# EAGLE design PowerMeter (EAGLE 6.1)
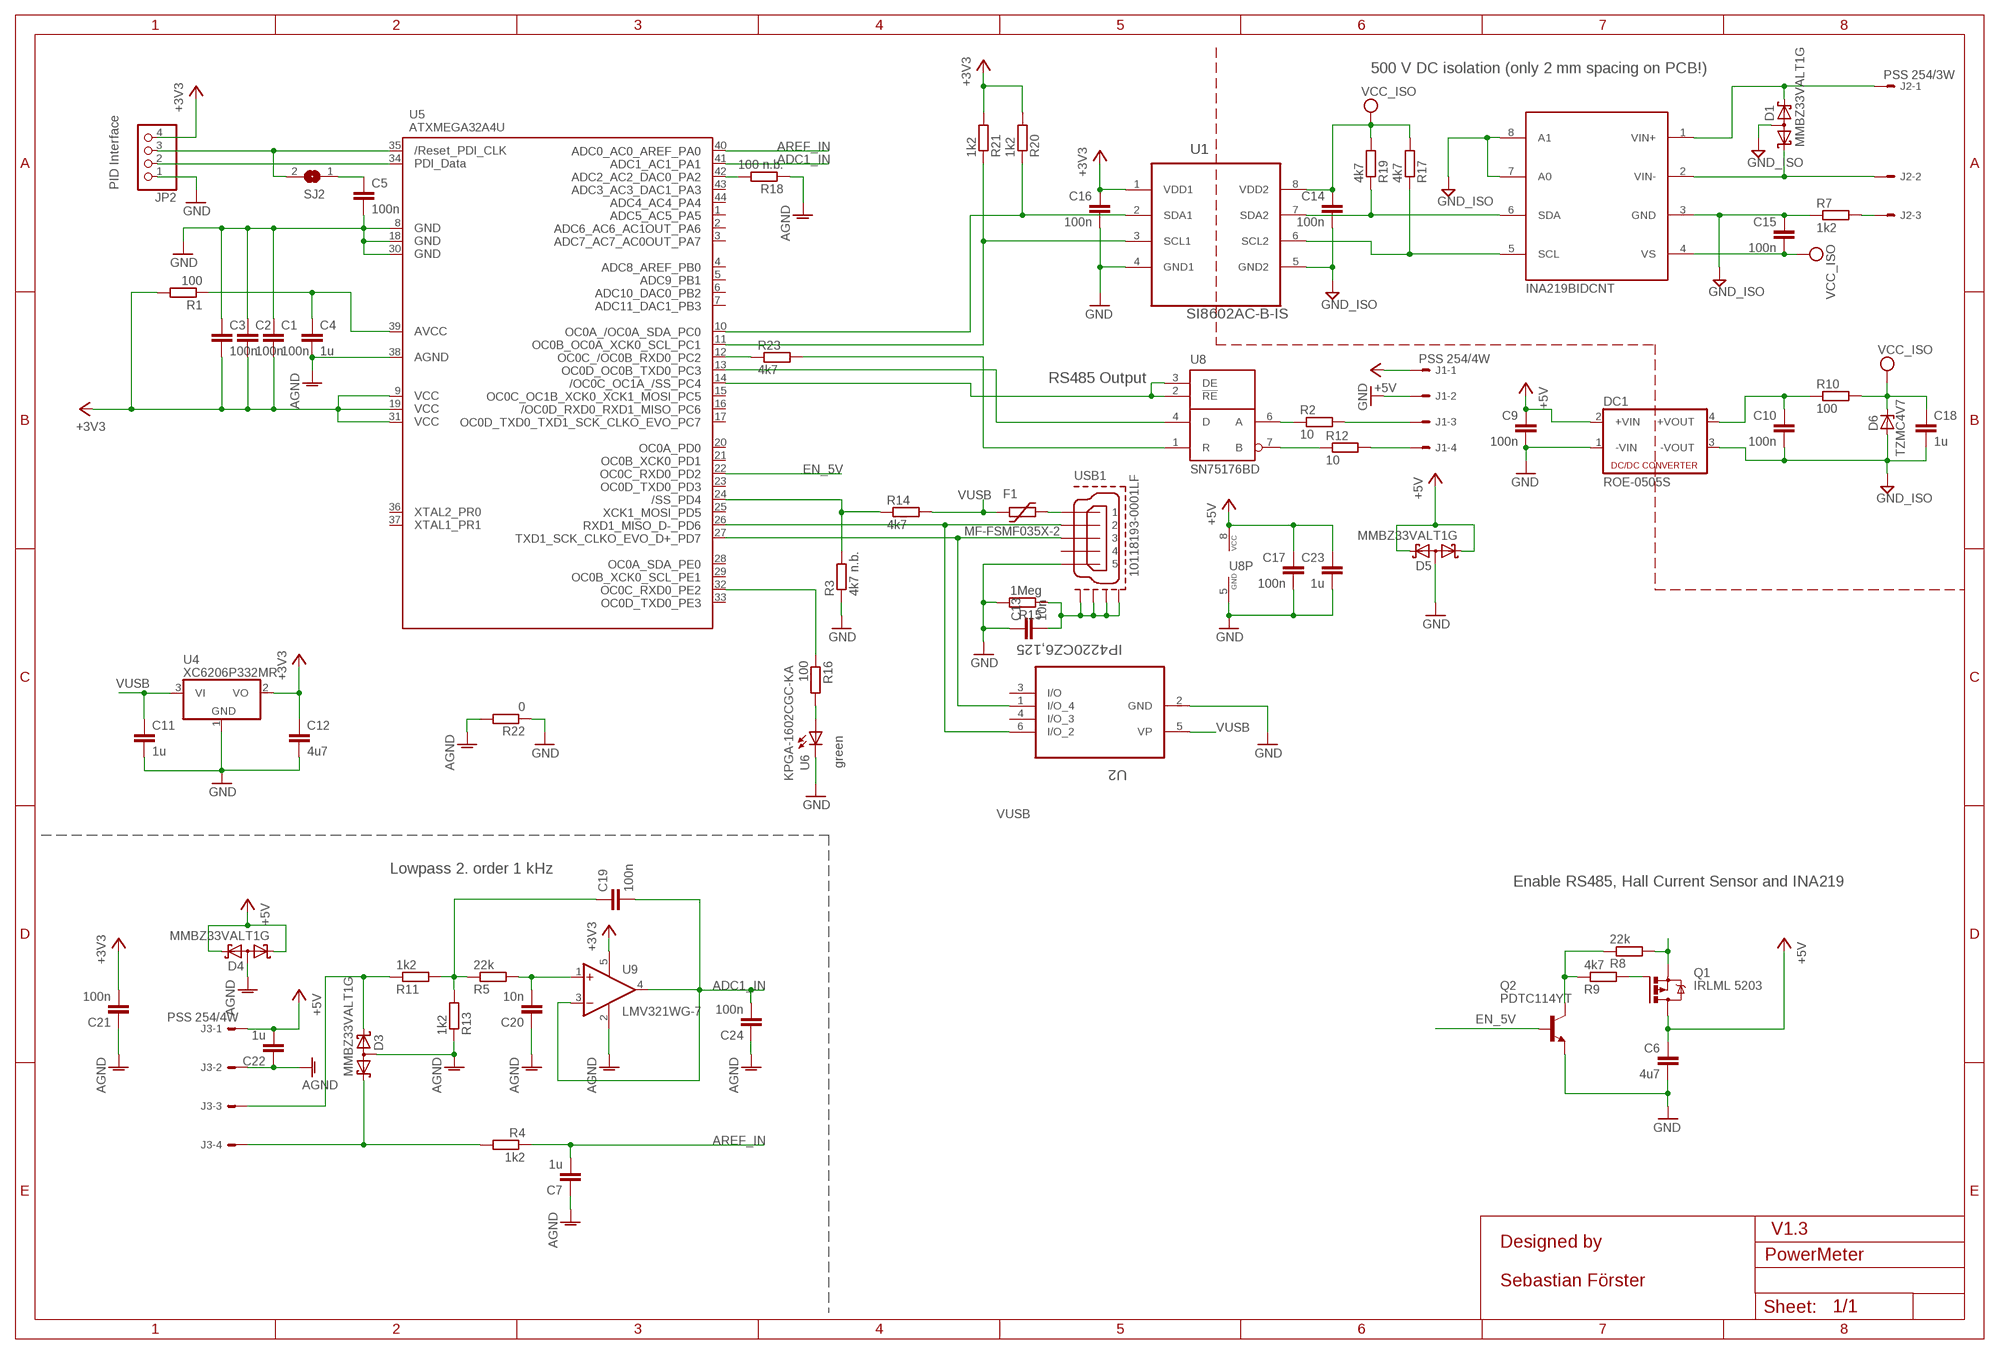
[diagram p0: schematic, sheet 1]

## Parts
C1  100n  C-EUC0603  [C0603]
C2  100n  C-EUC0603  [C0603]
C3  100n  C-EUC0603  [C0603]
C4  1u  C-EUC0603  [C0603]
C5  100n  C-EUC0603  [C0603]
C6  4u7  C-EUC0603  [C0603]
C7  1u  C-EUC0603  [C0603]
C9  100n  C-EUC0603  [C0603]
C10  100n  C-EUC0603  [C0603]
C11  1u  C-EUC0603  [C0603]
C12  4u7  C-EUC0603  [C0603]
C13  10n  C-EUC0603  [C0603]
C14  100n  C-EUC0603  [C0603]
C15  100n  C-EUC0603  [C0603]
C16  100n  C-EUC0603  [C0603]
C17  100n  C-EUC0603  [C0603]
C18  1u  C-EUC0603  [C0603]
C19  100n  C-EUC0603  [C0603]
C20  10n  C-EUC0603  [C0603]
C21  100n  C-EUC0603  [C0603]
C22  1u  C-EUC0603  [C0603]
C23  1u  C-EUC0603  [C0603]
C24  100n  C-EUC0603  [C0603]
D1  MMBZ33VALT1G  BAS40-06  [SOT23]
D3  MMBZ33VALT1G  BAS40-06  [SOT23]
D4  MMBZ33VALT1G  BAS40-06  [SOT23]
D5  MMBZ33VALT1G  BAS40-06  [SOT23]
D6  TZMC4V7  ZENER-DIODESOD80C  [SOD80C]
DC1  ROE-0505S  NME  [NME]
F1  MF-FSMF035X-2  PMS1812  [R0603]
J1  PSS 254/4W  22-27-2041-04  [6410-04]
J2  PSS 254/3W  22-27-2031-03  [6410-03]
J3  PSS 254/4W  22-27-2041-04  [6410-04]
JP2  PINHD-1X4_2.00  [1X04M]
Q1  IRLML 5203  IRLML5203  [MICRO3]
Q2  PDTC114YT  BC848ALT1SMD  [SOT23]
R1  100  R-EU_R0603  [R0603]
R2  10  R-EU_R0603  [R0603]
R3  4k7 n.b.  R-EU_R0603  [R0603]
R4  1k2  R-EU_R0603  [R0603]
R5  22k  R-EU_R0603  [R0603]
R7  1k2  R-EU_R0603  [R0603]
R8  22k  R-EU_R0603  [R0603]
R9  4k7  R-EU_R0603  [R0603]
R10  100  R-EU_R0603  [R0603]
R11  1k2  R-EU_R0603  [R0603]
R12  10  R-EU_R0603  [R0603]
R13  1k2  R-EU_R0603  [R0603]
R14  4k7  R-EU_R0603  [R0603]
R15  1Meg  R-EU_R0603  [R0603]
R16  100  R-EU_R0603  [R0603]
R17  4k7  R-EU_R0603  [R0603]
R18  100 n.b.  R-EU_R0603  [R0603]
R19  4k7  R-EU_R0603  [R0603]
R20  1k2  R-EU_R0603  [R0603]
R21  1k2  R-EU_R0603  [R0603]
R22  0  R-EU_R0603  [R0603]
R23  4k7  R-EU_R0603  [R0603]
SJ2  SJ  [SJ]
U1  SI8602AC-B-IS  ADUM1250ARZ  [SOIC127P600X175-8N]
U2  IP4220CZ6,125  IP4220CZ6  [SOT95P275X110-6N]
U4  XC6206P332MR  [SOT23]
U5  ATXMEGA32A4U  AVR_XMEGA_A4U_  [TQFP44]
U6  KPGA-1602CGC-KA  APA1606SURCK  [CHIP-LED0603]
U7  INA219BIDCNT  INA219  [SOT23-6]
U8  SN75176BD  75ALS176AD  [SO-08]
U9  LMV321WG-7  LMV321M5  [SOT23-5]
USB1  10118193-0001LF  MOLEX-47346-0001  [MOLEX-47364-0001]

## Nets
+3V3: C1.2 C2.2 C3.2 C12.1 C16.1 C21.2 JP2.4 R1.2 R20.2 R21.2 U1.1(VDD1) U4.2(VO) U5.9(VCC1) U5.19(VCC2) U5.31(VCC3) U9.5(V+)
+5V: C6.1 C9.1 C17.1 C22.2 C23.1 D4.1(K1) D4.2(K2) D5.1(K1) D5.2(K2) DC1.2(+VIN) J1.1 J3.1 Q1.3(D) U8.8(VCC)
ADC1_IN: C19.2 C24.2 U5.41(PA1) U9.3(-IN) U9.4(OUT)
AGND: C4.2 C7.1 C20.1 C21.1 C22.1 C24.1 D3.3(AA) D4.3(AA) J3.2 R13.1 R18.1 R22.2 U5.38(AGND) U9.2(V-)
AREF_IN: C7.2 R4.1 U5.40(PA0)
EN_5V: Q2.1(B) U5.22(PD2)
GND: C1.1 C2.1 C3.1 C5.2 C6.2 C9.2 C11.2 C12.2 C13.1 C16.2 C17.2 C23.2 D5.3(AA) DC1.1(-VIN) J1.2 JP2.1 Q2.2(E) R3.1 R15.2 R22.1 U1.4(GND1) U2.2(GND) U4.1(GND) U5.8(GND1) U5.18(GND2) U5.30(GND3) U6.C U8.5(GND) USB1.5
GND1: C10.2 C14.2 C15.1 C18.2 D1.3(AA) D6.A DC1.3(-VOUT) R7.1 U1.5(GND2) U7.3(GND) U7.7(A0) U7.8(A1) ; supply symbol labelled GND_ISO
GPS_ENABLE: Q2.3(C) R8.1 R9.1
N$1: R23.2 U8.1(R)
N$2: D1.1(K1) J2.2 U7.2(VIN-)
N$4: R20.1 U1.2(SDA1) U5.10(PC0)
N$5: J2.3 R7.2
N$6: R3.2 R14.1 U5.24(PD4)
N$7: D1.2(K2) J2.1 U7.1(VIN+)
N$8: C5.1 SJ2.1
N$9: C4.1 R1.1 U5.39(AVCC)
N$10: JP2.3 SJ2.2 U5.35(RESET)
N$11: JP2.2 U5.34(PDI_DATA)
N$12: C20.2 R5.2 U9.1(+IN)
N$13: R12.1 U8.7(B)
N$14: Q1.1(G) R9.2
N$15: F1.2 USB1.1
N$16: J1.3 R2.2
N$17: R2.1 U8.6(A)
N$18: J1.4 R12.2
N$19: U5.13(PC3) U8.4(D)
N$20: D3.1(K1) J3.4 R4.2
N$21: C13.2 R15.1 USB1.GND1 USB1.GND2 USB1.GND3 USB1.GND4
N$22: U2.6(I/O_2) U5.26(PD6) USB1.2
N$23: C19.1 R5.1 R11.2 R13.2
N$24: U2.1(I/O_4) U5.27(PD7) USB1.3
N$25: D3.2(K2) J3.3 R11.1
N$26: R16.2 U6.A
N$27: R21.1 U1.3(SCL1) U5.11(PC1)
N$28: U5.14(PC4) U8.2(!RE) U8.3(DE)
N$29: R17.1 U1.6(SCL2) U7.5(SCL)
N$30: R19.1 U1.7(SDA2) U7.6(SDA)
N$31: R18.2 U5.42(PA2)
N$32: R23.1 U5.12(PC2)
N$36: R16.1 U5.32(PE2)
VCC: C14.1 C15.2 C18.1 D6.C R10.2 R17.2 R19.2 U1.8(VDD2) U7.4(VS) ; supply symbol labelled VCC_ISO
VCC_ISO: C10.1 DC1.4(+VOUT) R10.1
VUSB: C11.1 F1.1 Q1.2(S) R8.2 R14.2 U2.5(VP) U4.3(VI)
Unconnected: U2.3(I/O) U2.4(I/O_3) U5.1(PA5) U5.2(PA6) U5.3(PA7) U5.4(PB0) U5.5(PB1) U5.6(PB2) U5.7(PB3) U5.15(PC5) U5.16(PC6) U5.17(PC7) U5.20(PD0) U5.21(PD1) U5.23(PD3) U5.25(PD5) U5.28(PE0) U5.29(PE1) U5.33(PE3) U5.36(PR0) U5.37(PR1) U5.43(PA3) U5.44(PA4) USB1.4

## Notes on the sheet
- 500 V DC isolation (only 2 mm spacing on PCB!)
- PID Interface
- INA219BIDCNT
- RS485 Output
- green
- Lowpass 2. order 1 kHz
- Enable RS485, Hall Current Sensor and INA219
- V1.3
- Designed by
- Sebastian Förster

## Library data of the parts
C1-C7 C9-C24 = rcl:C-EU: CAPACITOR, European symbol
D1 D3-D5 = diode:BAS40-06: Silicon Schottky Diodes General-purpose diode for high-speed switching
D6 = diode:ZENER-DIODE: Z-Diode
DC1 = dc-dc-converter:NME: DC-DC CONVERTER
F1 = ptc-littlefuse:PMS1812: PMS1812-050 PPTC .5A 15V 1812
J1 J3 = con-molex:22-?-04: CONNECTOR wire to board 2.54 mm (.1 inch) pitch header; OC_FARNELL: unknown; OC_NEWARK: unknown
J2 = con-molex:22-?-03: CONNECTOR wire to board 2.54 mm (.1 inch) pitch header; OC_FARNELL: unknown; OC_NEWARK: unknown
JP2 = pinhead:PINHD-1X4: PIN HEADER
Q1 = transistor-power:IRLML5203: HEXFET P-Channel Power MOSFET
Q2 = transistor-npn:BC848*: NPN Transistor
R1-R5 R7-R23 = rcl:R-EU_: RESISTOR, European symbol
SJ2 = jumper:SJ: SMD solder JUMPER
U1 = ADUM1250:ADUM1250ARZ: Hot Swappable, Dual I2C Isolators; MPN: ADUM1250ARZ; OC_FARNELL: 1814353; OC_NEWARK: 27M9880; PACKAGE: SOIC-8; SUPPLIER: Analog Devices
U2 = USB_ESD_NXP_IP4220CZ6:IP4220CZ6: Dual Schmitt-Trigger Inverter; MPN: IP4220CZ6; OC_FARNELL: 1506629; OC_NEWARK: 61M6815; PACKAGE: SSOT-6; SUPPLIER: NXP
U4 = LDO_AAT3220:XC6206P332MR
U5 = xmega:AVR_XMEGA_A4U_
U6 = led_sideview:APA1606SURCK
U7 = INA219:INA219: DESCRIPTION The INA219 is a high-side current shunt and power monitor with an I2C interface. The INA219 monitors both shunt drop and supply voltage, with programmable conversion times and filtering. A programmable calibration value, combined with an internal multiplier, enables direct readouts in amperes. An additional multiplying register calculates power in watts. The I2C interface features 16 programmable addresses.
U8 = texas:75ALS176: DIFFERENTIAL BUS TRANSCEIVERS TIA/EIA-422-B, TIA/EIA-422-B + TIA/EIA-422-B TIA/EIA-422-B Operate at Data Rates up to 35 Mbaud Source: http://focus.ti.com/lit/ds/symlink/sn65als176.pdf; MF: TEXAS INSTRUMENTS; MPN: SN75ALS176AD; OC_FARNELL: 1410742; OC_NEWARK: 76C5099
U9 = linear:LMV321?*: General Purpose, Low Voltage, Rail-to-Rail Output Operational Amplifiers Source: http://www.national.com/mpf/LM/LMV321.html http://www.national.com/dt/lmv_qual.pdf
USB1 = usb_con-update:MOLEX-47346-0001: MICRO USB B, BOTTOM MOUNT

## Board
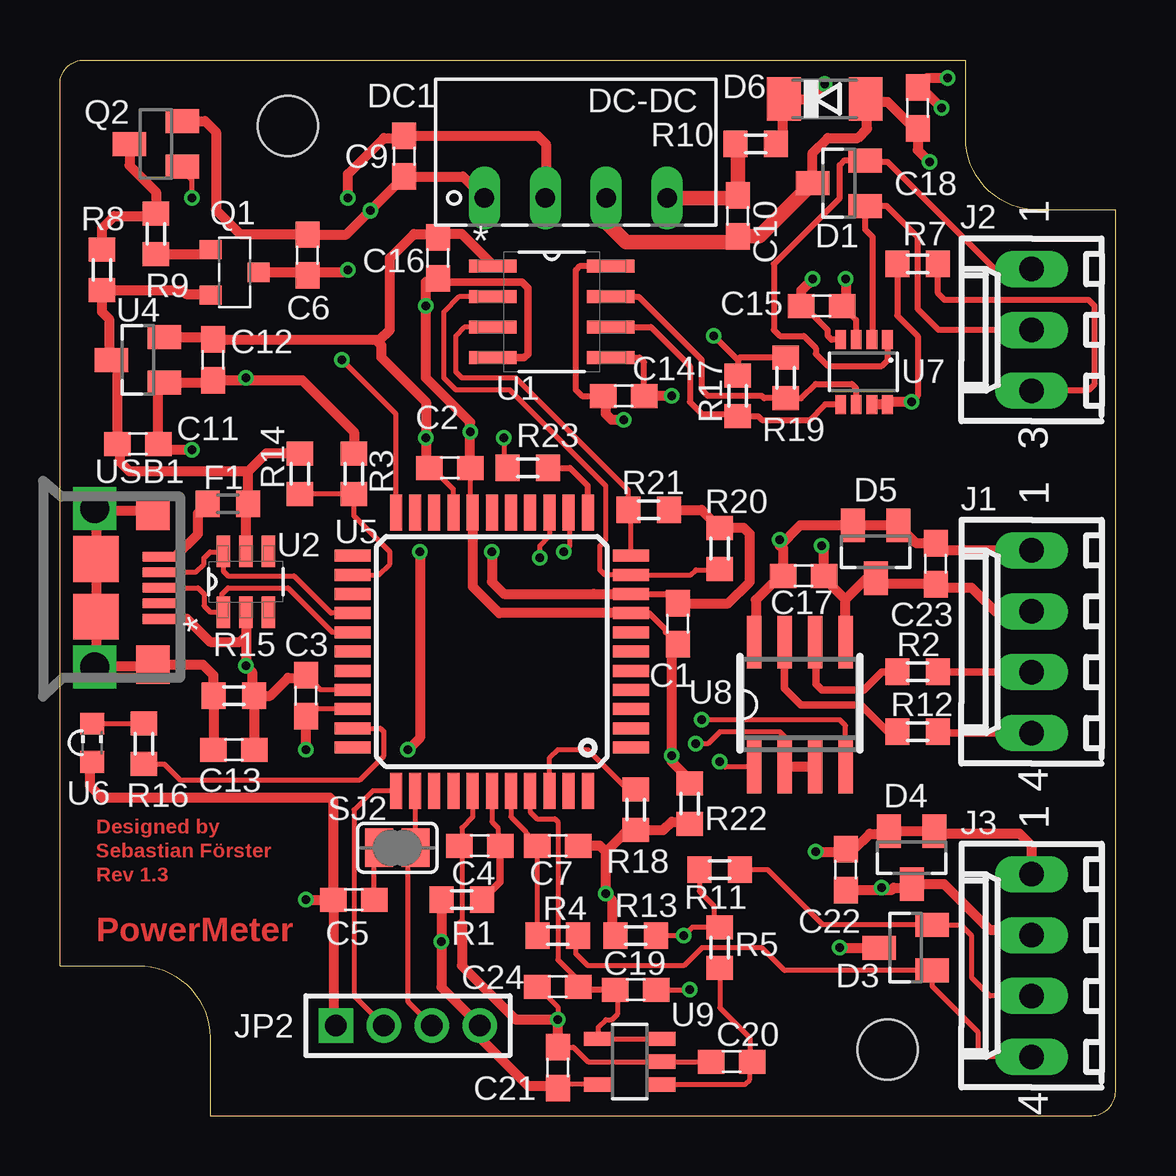
[diagram p1: board, top side]
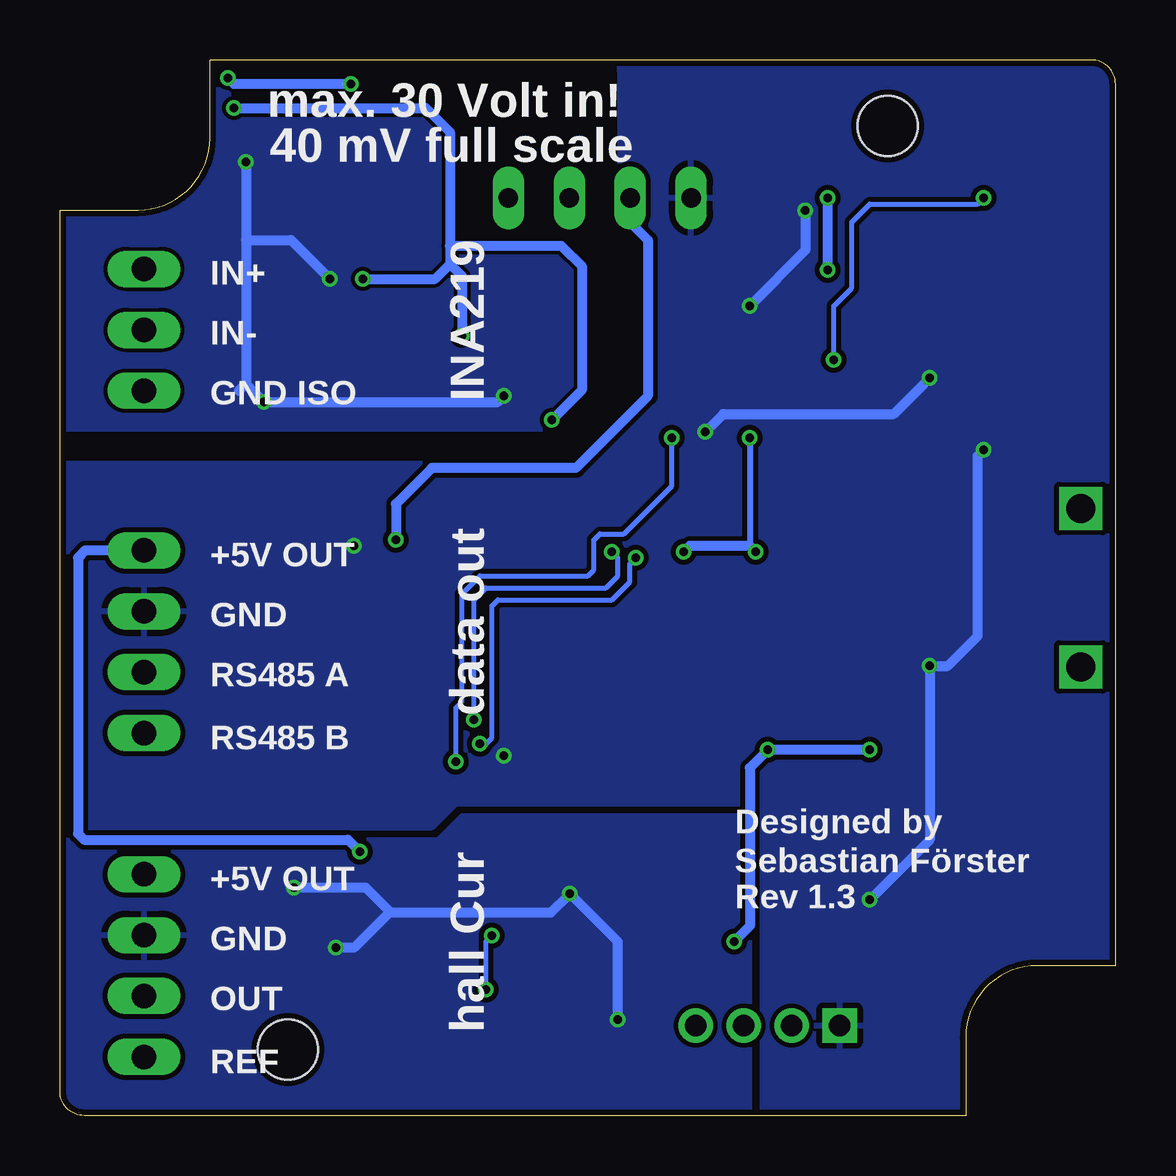
[diagram p2: board, bottom side, seen from below]

Size 44 x 44 mm. Coordinates in mm from the lower left corner, seen from the top.
Outline: 0,6.25 3.25,6.25 arc-90 6.25,3.25 6.25,0 43,0 arc90 44,1 44,37.75 40.75,37.75 arc-90 37.75,40.75 37.75,44 1,44 arc90 0,43 0,6.25
Copper layers (1*16): Top 0.035mm / dielectric 1.5mm / Bottom 0.035mm
Design rules: minimum track width 6mil, minimum drill 12mil, track to track 6mil, track to pad 6mil, pad to pad 6mil, via to via 6mil, smd to smd 0mil, copper to edge 10mil, drill to drill 10mil, minimum pad ring 10mil, minimum via ring 6mil, stop-mask expansion 2mil, vias tented up to drill 14mil, thermal gap 10mil
Holes 2.5 mm at 9.5,41.25 34.5,2.75
tRestrict: area 32.1,0.4 to 36.9,5.1; area 7.1,38.9 to 11.9,43.6; 5 lines
bRestrict: 5 lines

### Footprints (pad centres in the part's own frame; a part is rotated, then mirrored left to right if it is on the bottom)
C0603 = smd 1.1 x 1: 1 -0.85,0; 2 0.85,0
SOT23 = smd 1 x 1.4: 1 -0.95,-1.1; 2 0.95,-1.1; 3 0,1.1
SOD80C = smd 1.4 x 1.8: A 1.7,0; C -1.7,0
NME = drill 0.813 long: 1 0,3.81; 2 0,1.27; 3 0,-1.27; 4 0,-3.81
R0603 = smd 1 x 1.1: 1 -0.85,0; 2 0.85,0
6410-04 = drill 1.016 long: 1 3.81,0; 2 1.27,0; 3 -1.27,0; 4 -3.81,0
6410-03 = drill 1.016 long: 1 2.54,0; 2 0,0; 3 -2.54,0
1X04M = drill 0.914 square: 1 -3,0 | drill 0.914: 2 -1,0; 3 1,0; 4 3,0
MICRO3 = smd 0.8 x 0.9: 1 -0.95,-1; 2 0.95,-1; 3 0,1
SJ = smd 1.168 x 1.6: 1 -0.762,0; 2 0.762,0
SOIC127P600X175-8N = smd 1.981 x 0.559: 1 -2.464,1.905; 2 -2.464,0.635; 3 -2.464,-0.635; 4 -2.464,-1.905; 5 2.464,-1.905; 6 2.464,-0.635; 7 2.464,0.635; 8 2.464,1.905
SOT95P275X110-6N = smd 1.321 x 0.559: 1 -1.27,0.94; 2 -1.27,0; 3 -1.27,-0.94; 4 1.27,-0.94; 5 1.27,0; 6 1.27,0.94
TQFP44 = smd 1.5 x 0.5: 1 -5.8,4; 2 -5.8,3.2; 3 -5.8,2.4; 4 -5.8,1.6; 5 -5.8,0.8; 6 -5.8,0; 7 -5.8,-0.8; 8 -5.8,-1.6; 9 -5.8,-2.4; 10 -5.8,-3.2; 11 -5.8,-4; 23 5.8,-4; 24 5.8,-3.2; 25 5.8,-2.4; 26 5.8,-1.6; 27 5.8,-0.8; 28 5.8,0; 29 5.8,0.8; 30 5.8,1.6; 31 5.8,2.4; 32 5.8,3.2; 33 5.8,4 | smd 0.5 x 1.5: 12 -4,-5.8; 13 -3.2,-5.8; 14 -2.4,-5.8; 15 -1.6,-5.8; 16 -0.8,-5.8; 17 0,-5.8; 18 0.8,-5.8; 19 1.6,-5.8; 20 2.4,-5.8; 21 3.2,-5.8; 22 4,-5.8; 34 4,5.8; 35 3.2,5.8; 36 2.4,5.8; 37 1.6,5.8; 38 0.8,5.8; 39 0,5.8; 40 -0.8,5.8; 41 -1.6,5.8; 42 -2.4,5.8; 43 -3.2,5.8; 44 -4,5.8
CHIP-LED0603 = smd 1 x 0.9: A 0,0.8; C 0,-0.8
SOT23-6 = smd 0.45 x 0.8: 1 -1,-1.35; 2 -0.35,-1.35; 3 0.3,-1.35; 4 0.95,-1.35; 5 0.95,1.35; 6 0.3,1.35; 7 -0.35,1.35; 8 -1,1.35
SO-08 = smd 0.6 x 2.2: 1 -1.905,-2.6; 2 -0.635,-2.6; 3 0.635,-2.6; 4 1.905,-2.6; 5 1.905,2.6; 6 0.635,2.6; 7 -0.635,2.6; 8 -1.905,2.6
SOT23-5 = smd 0.6 x 1.2: 1 -0.95,-1.306; 2 0,-1.306; 3 0.95,-1.306; 4 0.95,1.306; 5 -0.95,1.306
MOLEX-47364-0001 = smd 1.35 x 0.4: 1 2.67,1.3; 2 2.67,0.65; 3 2.67,0; 4 2.67,-0.65; 5 2.67,-1.3 | smd 1.9 x 1.9: GND1 0.05,1.2; GND4 0.05,-1.2 | smd 1.4 x 1.6: GND2 2.43,3.2; GND3 2.43,-3.2 | drill 1.2 square: P$1 0,-3.3; P$2 0,3.3

### Placement (x,y rotation side)
C1  25.75,20.5 90 top
C2  16.25,27 180 top
C3  10.25,17.5 270 top
C4  17.5,11.25 180 top
C5  12.25,9 180 top
C6  10.32,35.87 90 top
C7  20.75,11.25 180 top
C9  14.35,39.99 270 top
C10  28.25,37.5 270 top
C11  3.25,28 0 top
C12  6.38,31.5 270 top
C13  7.25,15.25 180 top
C14  23.5,30 0 top
C15  31.75,33.75 180 top
C16  15.75,35.75 270 top
C17  31,22.5 0 top
C18  35.75,42 270 top
C19  24,5.25 180 top
C20  28,2.25 0 top
C21  20.75,2 270 top
C22  32.75,10.25 90 top
C23  36.5,23 270 top
C24  20.75,5.38 0 top
D1  32.47,38.86 90 top
D3  35.25,7 90 top
D4  35.5,10.75 180 top
D5  34,23.5 180 top
D6  31.88,42.38 0 top
DC1  21.5,38.25 90 top
F1  7,25.5 180 top
J1  40.5,19.75 90 top
J2  40.5,32.75 90 top
J3  40.5,6.25 90 top
JP2  14.5,3.75 0 top
Q1  7.28,35.15 270 top
Q2  4,40.5 90 top
R1  16.75,9 180 top
R2  35.75,18.5 0 top
R3  12.25,26.75 270 top
R4  20.75,7.5 0 top
R5  27.5,7 270 top
R7  35.75,35.5 0 top
R8  1.75,35.25 270 top
R9  4,36.75 270 top
R10  29,40.5 0 top
R11  27.5,10.25 180 top
R12  35.75,16 0 top
R13  24,7.5 0 top
R14  10,26.75 90 top
R15  7.25,17.5 0 top
R16  3.5,15.5 90 top
R17  28.25,30 90 top
R18  24,12.75 90 top
R19  30.25,30.75 90 top
R20  27.5,23.64 90 top
R21  24.54,25.25 0 top
R22  26.25,13 270 top
R23  19.5,27 180 top
SJ2  14.06,11.16 0 top
U1  20.5,33.5 0 top
U2  7.75,22.25 90 top
U4  3.25,31.5 90 top
U5  18,19.34 180 top
U6  1.34,15.54 0 top
U7  33.49,30.99 180 top
U8  30.84,17.13 0 top
U9  23.75,2.25 90 top
USB1  1.45,22 0 top

### Tracks (layer width: path | path; a pad name or v marks a point on that pad's centre or on a via)
+3V3  (via drill 0.35)
  Top 0.203: U5.31 10.54,16.94 C3.2 | U9.5 20.9,1.3 C21.2 | C2.2 15.5,27 16.4,26.1 U5.19
  Top 0.254: U5.9 25.26,21.74 25.75,21.25 C1.2 | 22.26,21.74 22.25,21.75
  Top 0.406: R21.2 26.74,25.25 R20.2 28.5,24.5 28.75,24.25 28.75,22.25 27.85,21.35 C1.2 | U4.2 6.15,32.45 C12.1 13.35,32.35 | U1.1 18,35.44 18,35.5 16.75,36.75 15.75,36.75 | 13.35,32.35 13.75,32.75 13.75,35.75 14.75,36.75 15.75,36.75 | C2.2 15.25,27.15 v15.25,28.25 15.25,29.75 13.4,31.6 13.4,32.1 13.25,32.25 13.35,32.35 | C21.2 20.65,1.25 19.5,1.25 17.5,3.25 JP2.4 15.9,5.35 v15.9,7.25 R1.2 | v10.25,15.25 C3.2 10.25,16.75 | v18,23.5 18,22.25 18.5,21.75 23.75,21.75 | 22.26,21.74 23.74,21.74 23.75,21.75 | U5.9 23.76,21.74 23.75,21.75 | C16.1 15.75,36.75 | v15,23.5 15,15.75 v14.5,15.25
  Bottom 0.254: v15.25,28.25 15.25,23.75
  Bottom 0.406: v15.9,7.25 15.25,7.9 15.25,14.5 v14.5,15.25 v10.25,15.25 | v18,23.5 17.75,23.75 15.25,23.75 v15,23.5
+5V  (via drill 0.35)
  Top 0.406: J3.1 40.5,11.25 40,11.75 36.55,11.75 D4.1 D4.2 34.45,11.75 33.75,11.75 33.1,11.1 C22.2 32.65,11 v31.5,11 | U8.8 29,19.8 29,21.5 30,22.5 C17.1 30.15,23.65 30,23.75 | 30,23.75 30.85,24.6 D5.2 D5.1 35.7,23.85 C23.1 36.79,23.56 J1.1 | Q1.3 10.19,35.15 | 10.19,35.15 C6.1 | 10.19,35.15 11.9,35.15 v12,35.25 | v12,38.25 12,39.25 13.5,40.75 14.25,40.75 C9.1 19.91,40.84 20.25,40.5 20.25,38.75 DC1.2 | v30,24 30,23.75
  Bottom 0.406: v12,35.25 v12,38.25 | DC1.2 20.23,37.23 19.5,36.5 19.5,30 22.5,27 28.5,27 30,25.5 v30,24 | J1.1 42.94,23.56 43.25,23.25 43.25,11.75 43,11.5 32,11.5 v31.5,11
ADC1_IN
  Top 0.203: U5.41 19.6,12.65 19.88,12.38 20.62,12.38 20.75,12.25 20.75,6.5 22,5.25 | C19.2 23.25,5.15 23.25,4.25 23,4 22.75,4 22.44,3.69 U9.4 U9.3 | C24.2 21.62,5.38
  Top 0.254: C19.2 22,5.25 21.75,5.25 21.62,5.38
AGND  (via drill 0.35)
  Top 0.203: U5.38 17.2,12.45 16.75,12 16.75,11.35 C4.2 16.75,11.25 16.75,8 | C21.1 21.4,2.85 22,2.25 U9.2 C20.1 | 23.85,11.75 R18.1 | C24.1 20.75,4.53 v20.75,4
  Top 0.406: C22.1 34.25,9.4 | 34.25,9.4 34.65,9.4 34.75,9.5 35.35,9.5 D4.3 36.85,9.65 38.75,7.75 40.27,7.75 J3.2 | C21.1 v20.75,4 19,4 16.75,6.25 16.75,8 | R13.1 23,7.65 23,9 v22.75,9.25 22.75,11 | 22.75,11 22.5,11.25 C7.1 21.5,11.25 | v34.25,9.5 34.25,9.4 | v32.5,7 D3.3 | R18.1 25.15,11.9 25.5,12.25 26.15,12.25 R22.2 | 23.85,11.75 23.5,11.75 22.75,11
  Bottom 0.406: v20.75,4 20.75,7.25 v22.75,9.25 23.55,8.45 30.2,8.45 30.25,8.5 | 30.25,8.5 31.25,9.5 v34.25,9.5 | 30.25,8.5 31.75,7 v32.5,7
  pour Bottom (isolate 0.203): 15.25,0 15.25,12.5 27.25,12.5 28.25,11.5 44,11.5 44,0.75 43.25,0
AREF_IN
  Top 0.203: U5.40 18.8,12.45 19.4,11.85 C7.2 20,11.25 19.9,11.15 R4.1
EN_5V  (via drill 0.35)
  Top 0.203: U5.22 14,29.25 v11.75,31.5 | v5.5,38.25 5.5,39 5,39.5 | 5,39.5 5.25,39.5 | Q2.1 5.05,39.55 5,39.5
  Bottom 0.203: v11.75,31.5 11.75,33.75 11,34.5 11,37.25 10.25,38 5.75,38 v5.5,38.25
GND  (via drill 0.35)
  Top 0.203: U5.30 10.86,17.74 C3.1 | C2.1 17.1,25.24 U5.18
  Top 0.254: U5.8 24.56,20.94 25.25,20.25 25.25,20.15 C1.1
  Top 0.305: C16.2 15.85,35.15 15.75,35 16.25,34.75 19.25,34.75 19.5,34.5 19.5,31.75 19.34,31.59 U1.4
  Top 0.406: R15.2 C13.1 | 32.74,21.5 31.85,22.4 C17.2 31.85,23.65 v31.75,23.75 | U8.5 32.74,21.5 | Q2.2 6.05,41.45 6.5,41 6.5,37.75 7.5,36.75 10.29,36.75 C6.2 11.93,36.72 v12.93,37.72 C9.2 16.8,39.14 DC1.1 | C5.2 11.4,13.1 11.25,13.25 1.75,13.25 1.25,13.75 1.25,14.65 U6.C | R15.2 8.75,17.5 9.5,18.25 10.15,18.25 C3.1 | U2.2 7.75,20 | 7.75,20 v7.75,18.75 8,18.5 8,17.6 R15.2 | USB1.5 5.3,20.7 6.25,19.75 7.5,19.75 7.75,20 | R22.1 26.25,14 25.5,14.75 v25.5,15 25.5,19.15 C1.1 | J1.2 38.98,21.02 38,22 36.65,22 C23.2 34.25,22.15 D5.3 33.64,22.4 32.74,21.5 | C11.2 4.1,30.2 U4.1 6.15,30.55 C12.2 10.1,30.65 12.25,28.5 R3.1 | C5.2 11.4,3.85 JP2.1 | C2.1 v17.1,28.5 17.1,28.9 15.25,30.75 v15.25,33.75 15.25,34.75 15.75,35 | v5.5,27.75 4.5,27.75 4.25,28 C11.2 | v10.25,9 C5.2 | U5.18 17.2,22.05 18.31,20.94 U5.8 | C11.2 4,28
  Bottom 0.406: v17.1,28.5 16.35,29.25 9.25,29.25 v7.75,30.75 | v5.5,27.75 5.75,27.5 5.75,20 7,18.75 v7.75,18.75 7.75,11.5 v10.25,9 | v12.93,37.72 12.93,36.07 v15.25,33.75
  pour Bottom (isolate 0.203): 0,43.25 0.75,44 21,44 21,37 20,36 20,30 22.5,27.5 44,27.5 44,12 28.5,12 27.5,13 14.75,13 14.75,0 6.25,0 6.25,4 4,6.25 0,6.25
GND1  (via drill 0.35)
  Top 0.254: C14.2 24.35,31.4 24.16,31.59 U1.5 | U7.3 33.19,33.16 C15.1 32.75,33.75 | R7.1 34.9,33.35 35.75,32.5 35.75,30 v35.5,29.75 | D6.A 33.58,42.17 33.62,42.12
  Top 0.406: D1.3 31.37,40.12 32,40.75 33.25,40.75 33.65,41.15 33.62,41.15 33.62,42.12 33.62,42.38 | v36.25,39.75 35.75,40.25 C18.2 35.6,41.15 34.5,42.25 33.7,42.25 D6.A | v35.5,29.75 34.6,29.75 U7.8 U7.7 | v25.5,30 C14.2 | v32.75,34.88 32.75,33.75
  Top 0.61: 28.25,36.62 C10.2 | C10.2 29.16,36.65 D1.3 | DC1.3 22.75,38 22.75,37.25 23.6,36.4 28.25,36.4 C10.2
  Bottom 0.406: v36.25,39.75 36.25,36.5 | v25.5,30 25.75,29.75 v35.5,29.75 36.25,30.5 | 36.25,36.5 34.38,36.5 v32.75,34.88 | 36.25,36.5 36.25,30.5 | 36.54,30.21 36.25,30.5
  pour Bottom: 27.5,44 37.75,44 37.75,40.25 40.25,37.75 44,37.75 44,28.5 23,28.5 21,30.5 21,35.5 22,36.5 27.5,36.5
GPS_ENABLE
  Top 0.406: R8.1 1.75,37 2.25,37.5 3.9,37.5 R9.1 4,38.5 2.9,39.6 Q2.3
N$1  (via drill 0.35)
  Top 0.203: U8.1 27.72,14.53 v27.5,14.75 | v18.5,28.25 18.5,27.15 R23.2
  Bottom 0.203: v27.5,14.75 27.5,17 27.25,17.25 27.25,21.75 26.5,22.5 22,22.5 21.75,22.75 21.75,24 21.5,24.25 20.5,24.25 18.5,26.25 v18.5,28.25
N$2
  Top 0.254: 33.5,37.84 D1.1 | U7.2 33.88,32.38 33.88,36.62 33.57,36.93 D1.1 | J2.2 36.62,32.75 35.75,33.62 35.75,36.62 34.47,37.91 D1.1
N$4
  Top 0.203: R20.1 27.46,22.75 26.5,22.75 26.29,22.54 U5.10 22.71,22.54 22.5,22.75 22.5,23.75 22.75,24 22.75,26.25 18.75,30.25 16.5,30.25 16,30.75 16,33.5 16.64,34.13 U1.2
N$5
  Top 0.254: J2.3 40.54,30.25 42.88,30.25 43.12,30.5 43.12,33.75 42.88,34 36.88,34 36.6,34.27 R7.2
N$6
  Top 0.203: U5.24 13.29,22.54 13.75,23 13.75,23.5 12.25,25 R3.2 R14.1
N$7
  Top 0.254: J2.1 38.96,35.29 34.5,39.75 33.5,39.75 D1.2 | 34.5,32.25 34.5,31.5 34.25,31.25 32,31.25 31.5,31.75 31.5,32 31,32.5 30,32.5 29.75,32.75 29.75,35.5 32.5,38.25 32.5,39.62 32.69,39.81 D1.2 | D1.2 33.62,39.88
  Top 0.406: 34.5,32.25 34.49,32.25 U7.1
N$8
  Top 0.203: C5.1 13.1,10.96 SJ2.1
N$9
  Top 0.203: U5.39 18,12.25 18.25,12 18.25,11.35 C4.1
  Top 0.305: C4.1 18.35,9.75 R1.1
N$10
  Top 0.203: U5.35 14.82,13.52 SJ2.2 14.5,10.84 14.5,4.75 JP2.3
N$11
  Top 0.203: U5.34 13.04,13.54 12.25,12.75 12.25,5 JP2.2
N$12
  Top 0.203: R5.2 27.5,4.5 28.75,3.25 28.75,2.5 29,2.25 C20.2 | U9.1 28.55,1.3 28.75,1.5 28.75,2.15 C20.2 | C20.2 28.75,2.25
N$13
  Top 0.305: R12.1 34.5,16 33.38,17.12 30.88,17.12 30.2,17.8 U8.7
N$14
  Top 0.406: R9.2 6.08,35.9 Q1.1
N$15
  Top 0.406: USB1.1 4.8,23.3 5.75,24.25 5.75,25.1 F1.2
N$16
  Top 0.305: J1.3 36.62,18.48 R2.2
N$17
  Top 0.305: R2.1 34.25,18.5 33.5,17.75 31.75,17.75 31.5,18 31.5,19.7 U8.6
N$18
  Top 0.305: J1.4 36.75,15.94 36.56,15.94 36.5,16
  Top 0.406: R12.2 36.75,16 36.75,15.94
N$19  (via drill 0.35)
  Top 0.203: U8.4 32.74,16.25 32.5,16.5 v26.75,16.5 | v21,23.5 21.25,23.75 21.25,25.09 U5.13
  Bottom 0.203: v26.75,16.5 26.75,21.5 26.25,22 21.25,22 20.75,22.5 20.75,23.25 v21,23.5
N$20
  Top 0.203: J3.4 38.56,2.44 38.25,2.75 38.25,3.5 36.35,5.4 D3.1 30.2,6.05 29.25,7 26.75,7 26,6.25 22,6.25 21.5,6.75 21.5,7.5
  Top 0.406: 21.5,7.5 R4.2
N$21
  Top 0.203: USB1.GND1 1.5,23.25
  Top 0.406: USB1.GND2 1.7,25.2 1.5,25 1.5,23.25 | USB1.GND1 USB1.GND4 1.5,19 1.75,18.75 3.83,18.75 USB1.GND3 5.95,18.8 6.4,18.35 R15.1 C13.2
N$22
  Top 0.203: USB1.2 5.65,22.65 6,23 6,23.25 6.25,23.5 6.79,23.5 U2.6 6.81,22.69 7,22.5 9.75,22.5 11.31,20.94 U5.26
N$23  (via drill 0.35)
  Top 0.203: R11.2 26.65,9.35 27.25,8.75 27.25,8.1 R5.1 26.35,7.85 v26,7.5 R13.2 | C19.1 v26.25,5.25
  Bottom 0.203: v26.25,5.25 26.25,7.25 v26,7.5
N$24
  Top 0.203: USB1.3 5.75,22 6,21.75 6,21.25 6.25,21 6.75,21 | 6.75,21 6.75,21.75 7,22 9.5,22 11.36,20.14 U5.27 | U2.1 6.77,20.98 6.75,21
N$25
  Top 0.203: J3.3 38.77,4.98 38,5.75 38,7.5 37.55,7.95 D3.2 31.8,7.95 29.5,10.25 R11.1
N$26
  Top 0.203: U6.A R16.2
N$27
  Top 0.203: U5.11 23.8,25.14 R21.1 23.69,26.06 19,30.75 16.75,30.75 16.5,31 16.5,32.5 16.86,32.87 U1.3
N$28  (via drill 0.35)
  Top 0.203: 30.25,14.53 30.25,15.75 30,16 27.5,16 27,15.5 v26.5,15.5 | v20,23.25 20,23.75 20.4,24.15 U5.14
  Top 0.406: U8.3 30.25,14.53 | 30.25,14.53 30.25,14.5 | 30.25,14.53 U8.2
  Bottom 0.203: v26.5,15.5 26.25,15.5 26,15.75 26,21.25 25.75,21.5 21,21.5 20.25,22.25 20.25,23 v20,23.25
N$29
  Top 0.254: U7.5 31.89,29.64 31.25,29 29.25,29 29.1,29.15 R17.1 28.15,29.25 26.75,29.25 26.25,29.75 26.25,31.25 24.64,32.87 U1.6
N$30
  Top 0.254: U7.6 33.19,30.31 33,30.5 31.5,30.5 30.9,29.9 R19.1 29.35,29.9 29.25,30 27,30 26.75,30.25 26.75,31.5 24.11,34.13 U1.7
N$31
  Top 0.203: R18.2 23.65,13.6 22,15.25 20.75,15.25 20.4,14.9 U5.42
N$32
  Top 0.254: R23.1 21.25,27 22,26.25 U5.12
N$36
  Top 0.203: R16.1 4.35,14.65 5,14 12.5,14 13.5,15 13.5,16 13.36,16.14 U5.32
VCC  (via drill 0.35)
  Top 0.254: U7.4 32.16,32.34 32,32.5 32,32.75 31,33.75 C15.2 | R19.2 28.35,31.6 28.25,31.5 | 28.25,31.5 R17.2 | C14.1 22.25,30 | U1.8 21.66,35.41 21.5,35.25 21.5,30.25 21.75,30 C14.1 | v27.25,32.5 28.25,31.5 | 22.75,30 C14.1 | 30.12,42.38 D6.C
  Top 0.406: v36.75,42 35.9,42.85 C18.1 36.15,43.25 v37,43.25 | v31.38,34.88 30.9,34.4 C15.2 | v23.5,29 23,29 22.75,29.25 22.75,29.9 C14.1 | R10.2 30.12,40.5 30.12,42.38 | D6.C 31.25,42.38 v31.88,43
  Bottom 0.406: v36.75,42 28.75,42 27.75,41 27.75,36.25 | 27.75,36.25 27.75,35.5 | 27.75,35.5 28.38,34.88 v31.38,34.88 | 27.75,35.5 27.25,35 v27.25,32.5 | v23.5,29 22.25,30.25 22.25,35.41 23.09,36.25 27.75,36.25 | v31.88,43 36.75,43 v37,43.25
VCC_ISO
  Top 0.406: 28.25,38.25 C10.1
  Top 0.61: DC1.4 28.25,38.25 | C10.1 28.25,40.4 R10.1
VUSB
  Top 0.406: U2.5 7.75,25.4 F1.1 7.85,26.85 | 7.85,26.85 8.6,27.6 R14.2 | 7.85,26.85 2.9,26.85 2.5,27.25 2.5,27.9 C11.1 2.4,31.15 U4.3 2.25,31.5 2.05,31.7 2.05,33.2 1.75,33.5 R8.2 5.1,34.4 5.25,34.25 6.23,34.25 Q1.2

### Text on the board
Top: Designed by | Sebastian Förster | Rev 1.3 | PowerMeter
bNames: max. 30 Volt in! | 40 mV full scale | INA219 | IN+ | IN- | GND ISO | data out | +5V OUT | GND | RS485 A | RS485 B | Designed by | hall Cur | Sebastian Förster | Rev 1.3 | +5V OUT | GND | OUT | REF